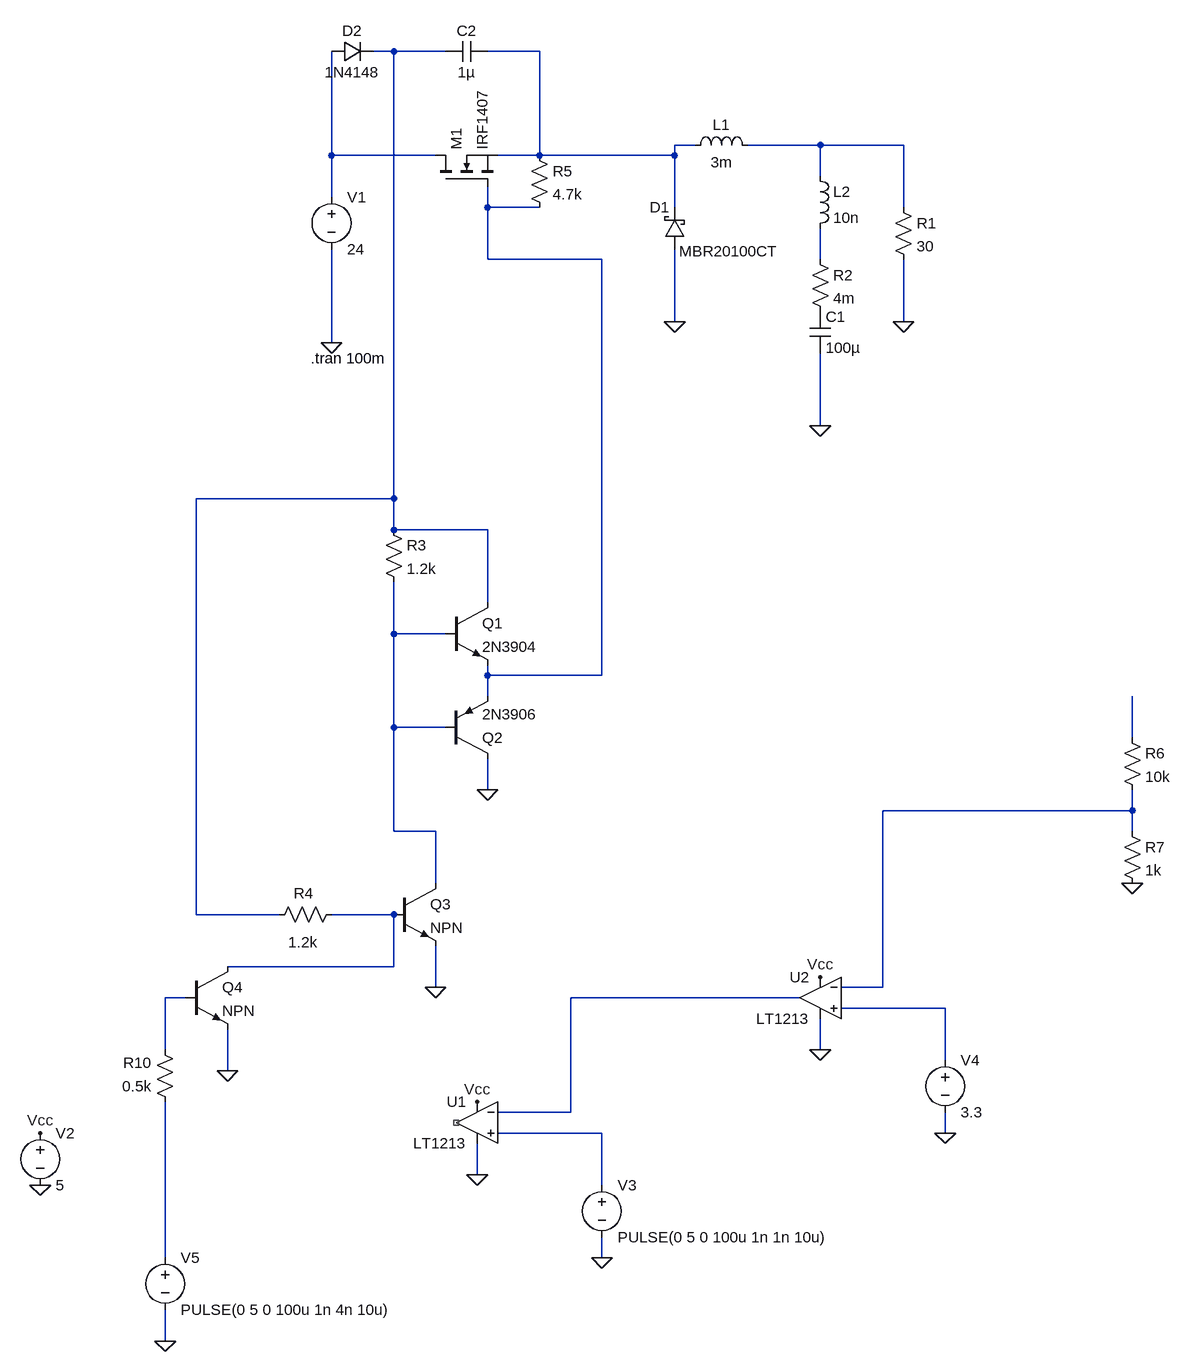
[diagram p0: schematic Driving Buck Converter Properly with feedback.asc]
Driving Buck Converter Properly with feedback.asc, the LTspice schematic file:
Version 4
SHEET 1 1468 1924
WIRE -128 -80 -160 -80
WIRE -48 -80 -128 -80
WIRE 96 -80 16 -80
WIRE 336 64 304 64
WIRE 528 64 416 64
WIRE 656 64 528 64
WIRE -224 80 -224 -80
WIRE -64 80 -224 80
WIRE 96 80 96 -80
WIRE 96 80 32 80
WIRE 304 80 304 64
WIRE 304 80 96 80
WIRE 528 112 528 64
WIRE -224 144 -224 80
WIRE 16 160 16 128
WIRE 96 160 16 160
WIRE 304 160 304 80
WIRE 656 160 656 64
WIRE 16 240 16 160
WIRE 192 240 16 240
WIRE 528 240 528 192
WIRE 304 336 304 224
WIRE 656 336 656 240
WIRE -224 368 -224 224
WIRE 528 496 528 384
WIRE -128 608 -128 -80
WIRE -128 608 -432 608
WIRE -128 656 -128 608
WIRE 16 656 -128 656
WIRE 16 768 16 656
WIRE -128 816 -128 736
WIRE -48 816 -128 816
WIRE 16 880 16 864
WIRE 192 880 192 240
WIRE 192 880 16 880
WIRE 16 912 16 880
WIRE -128 960 -128 816
WIRE -48 960 -128 960
WIRE 1008 976 1008 912
WIRE 16 1056 16 1008
WIRE 1008 1088 1008 1056
WIRE 1008 1088 624 1088
WIRE -128 1120 -128 960
WIRE -64 1120 -128 1120
WIRE 1008 1120 1008 1088
WIRE -64 1200 -64 1120
WIRE -432 1248 -432 608
WIRE -304 1248 -432 1248
WIRE -128 1248 -224 1248
WIRE -128 1328 -128 1248
WIRE -128 1328 -384 1328
WIRE -64 1360 -64 1296
WIRE 624 1360 624 1088
WIRE 624 1360 560 1360
WIRE -448 1376 -480 1376
WIRE 496 1376 144 1376
WIRE 720 1392 560 1392
WIRE -480 1456 -480 1376
WIRE 528 1456 528 1408
WIRE 720 1472 720 1392
WIRE -384 1488 -384 1424
WIRE 144 1552 144 1376
WIRE 144 1552 32 1552
WIRE 192 1584 32 1584
WIRE 720 1584 720 1552
WIRE 0 1648 0 1600
WIRE 192 1664 192 1584
WIRE -480 1776 -480 1536
WIRE 192 1776 192 1744
WIRE -480 1904 -480 1856
FLAG -224 368 0
FLAG 304 336 0
FLAG 528 496 0
FLAG 656 336 0
FLAG 16 1056 0
FLAG -64 1360 0
FLAG -672 1584 Vcc
FLAG 0 1536 Vcc
FLAG 0 1648 0
FLAG 192 1776 0
FLAG -672 1664 0
FLAG 528 1344 Vcc
FLAG 528 1456 0
FLAG 720 1584 0
FLAG 1008 1200 0
FLAG -384 1488 0
FLAG -480 1904 0
SYMBOL voltage -224 128 R0
WINDOW 123 0 0 Left 0
WINDOW 39 0 0 Left 0
SYMATTR InstName V1
SYMATTR Value 24
SYMBOL nmos -64 128 R270
SYMATTR InstName M1
SYMATTR Value IRF1407
SYMBOL ind 320 80 R270
WINDOW 0 32 56 VTop 2
WINDOW 3 5 56 VBottom 2
SYMATTR InstName L1
SYMATTR Value 3m
SYMBOL res 640 144 R0
SYMATTR InstName R1
SYMATTR Value 30
SYMBOL cap 512 320 R0
SYMATTR InstName C1
SYMATTR Value 100µ
SYMBOL schottky 320 224 R180
WINDOW 0 24 64 Left 2
WINDOW 3 -144 -3 Left 2
SYMATTR InstName D1
SYMATTR Value MBR20100CT
SYMATTR Description Diode
SYMATTR Type diode
SYMBOL res 512 224 R0
SYMATTR InstName R2
SYMATTR Value 4m
SYMBOL ind 512 96 R0
SYMATTR InstName L2
SYMATTR Value 10n
SYMBOL res -208 1232 R90
WINDOW 0 -1 59 VBottom 2
WINDOW 3 43 60 VTop 2
SYMATTR InstName R4
SYMATTR Value 1.2k
SYMBOL npn -48 768 R0
SYMATTR InstName Q1
SYMATTR Value 2N3904
SYMBOL pnp -48 1008 M180
SYMATTR InstName Q2
SYMATTR Value 2N3906
SYMBOL cap 16 -96 R90
WINDOW 0 0 32 VBottom 2
WINDOW 3 32 32 VTop 2
SYMATTR InstName C2
SYMATTR Value 1µ
SYMBOL diode -224 -64 R270
WINDOW 0 32 32 VTop 2
WINDOW 3 0 32 VBottom 2
SYMATTR InstName D2
SYMATTR Value 1N4148
SYMBOL res -144 640 R0
SYMATTR InstName R3
SYMATTR Value 1.2k
SYMBOL npn -128 1200 R0
SYMATTR InstName Q3
SYMBOL res 80 64 R0
SYMATTR InstName R5
SYMATTR Value 4.7k
SYMBOL OpAmps\\LT1213 0 1504 M0
SYMATTR InstName U1
SYMBOL voltage -672 1568 R0
WINDOW 123 0 0 Left 0
WINDOW 39 0 0 Left 0
SYMATTR InstName V2
SYMATTR Value 5
SYMBOL voltage 192 1648 R0
WINDOW 123 0 0 Left 0
WINDOW 39 0 0 Left 0
SYMATTR InstName V3
SYMATTR Value PULSE(0 5 0 100u 1n 1n 10u)
SYMBOL OpAmps\\LT1213 528 1312 M0
SYMATTR InstName U2
SYMBOL voltage 720 1456 R0
WINDOW 123 0 0 Left 0
WINDOW 39 0 0 Left 0
SYMATTR InstName V4
SYMATTR Value 3.3
SYMBOL res 992 960 R0
SYMATTR InstName R6
SYMATTR Value 10k
SYMBOL res 992 1104 R0
SYMATTR InstName R7
SYMATTR Value 1k
SYMBOL npn -448 1328 R0
SYMATTR InstName Q4
SYMBOL res -464 1552 R180
WINDOW 0 36 76 Left 2
WINDOW 3 36 40 Left 2
SYMATTR InstName R10
SYMATTR Value 0.5k
SYMBOL voltage -480 1760 R0
WINDOW 123 0 0 Left 0
WINDOW 39 0 0 Left 0
SYMATTR InstName V5
SYMATTR Value PULSE(0 5 0 100u 1n 4n 10u)
TEXT -256 392 Left 2 !.tran 100m

The netlist it stands for:
* Driving Buck Converter Properly with feedback.asc
V1 N004 0 24
M1 N004 N005 N002 N002 IRF1407
L1 N002 N003 3m
R1 N003 0 30
C1 P001 0 100µ
D1 0 N002 MBR20100CT
R2 N006 P001 4m
L2 N003 N006 10n
R4 N010 N001 1.2k
Q1 N001 N007 N005 0 2N3904
Q2 0 N007 N005 0 2N3906
C2 N002 N001 1µ
D2 N004 N001 1N4148
R3 N001 N007 1.2k
Q3 N007 N010 0 0 NPN
R5 N002 N005 4.7k
XU1 N014 N012 Vcc 0 NC_01 LT1213  ; pins In+ In- V+ V- OUT
V2 Vcc 0 5
V3 N014 0 PULSE(0 5 0 100u 1n 1n 10u)
XU2 N013 N009 Vcc 0 N012 LT1213  ; pins In+ In- V+ V- OUT
V4 N013 0 3.3
R6 N008 N009 10k
R7 N009 0 1k
Q4 N010 N011 0 0 NPN
R10 N015 N011 0.5k
V5 N015 0 PULSE(0 5 0 100u 1n 4n 10u)
.model D D
.lib standard.dio
.model NPN NPN
.model PNP PNP
.lib standard.bjt
.model NMOS NMOS
.model PMOS PMOS
.lib standard.mos
.tran 100m
.lib LTC.lib
.backanno
.end